# EAGLE schematic printcore_connector (EAGLE 9.5.0)
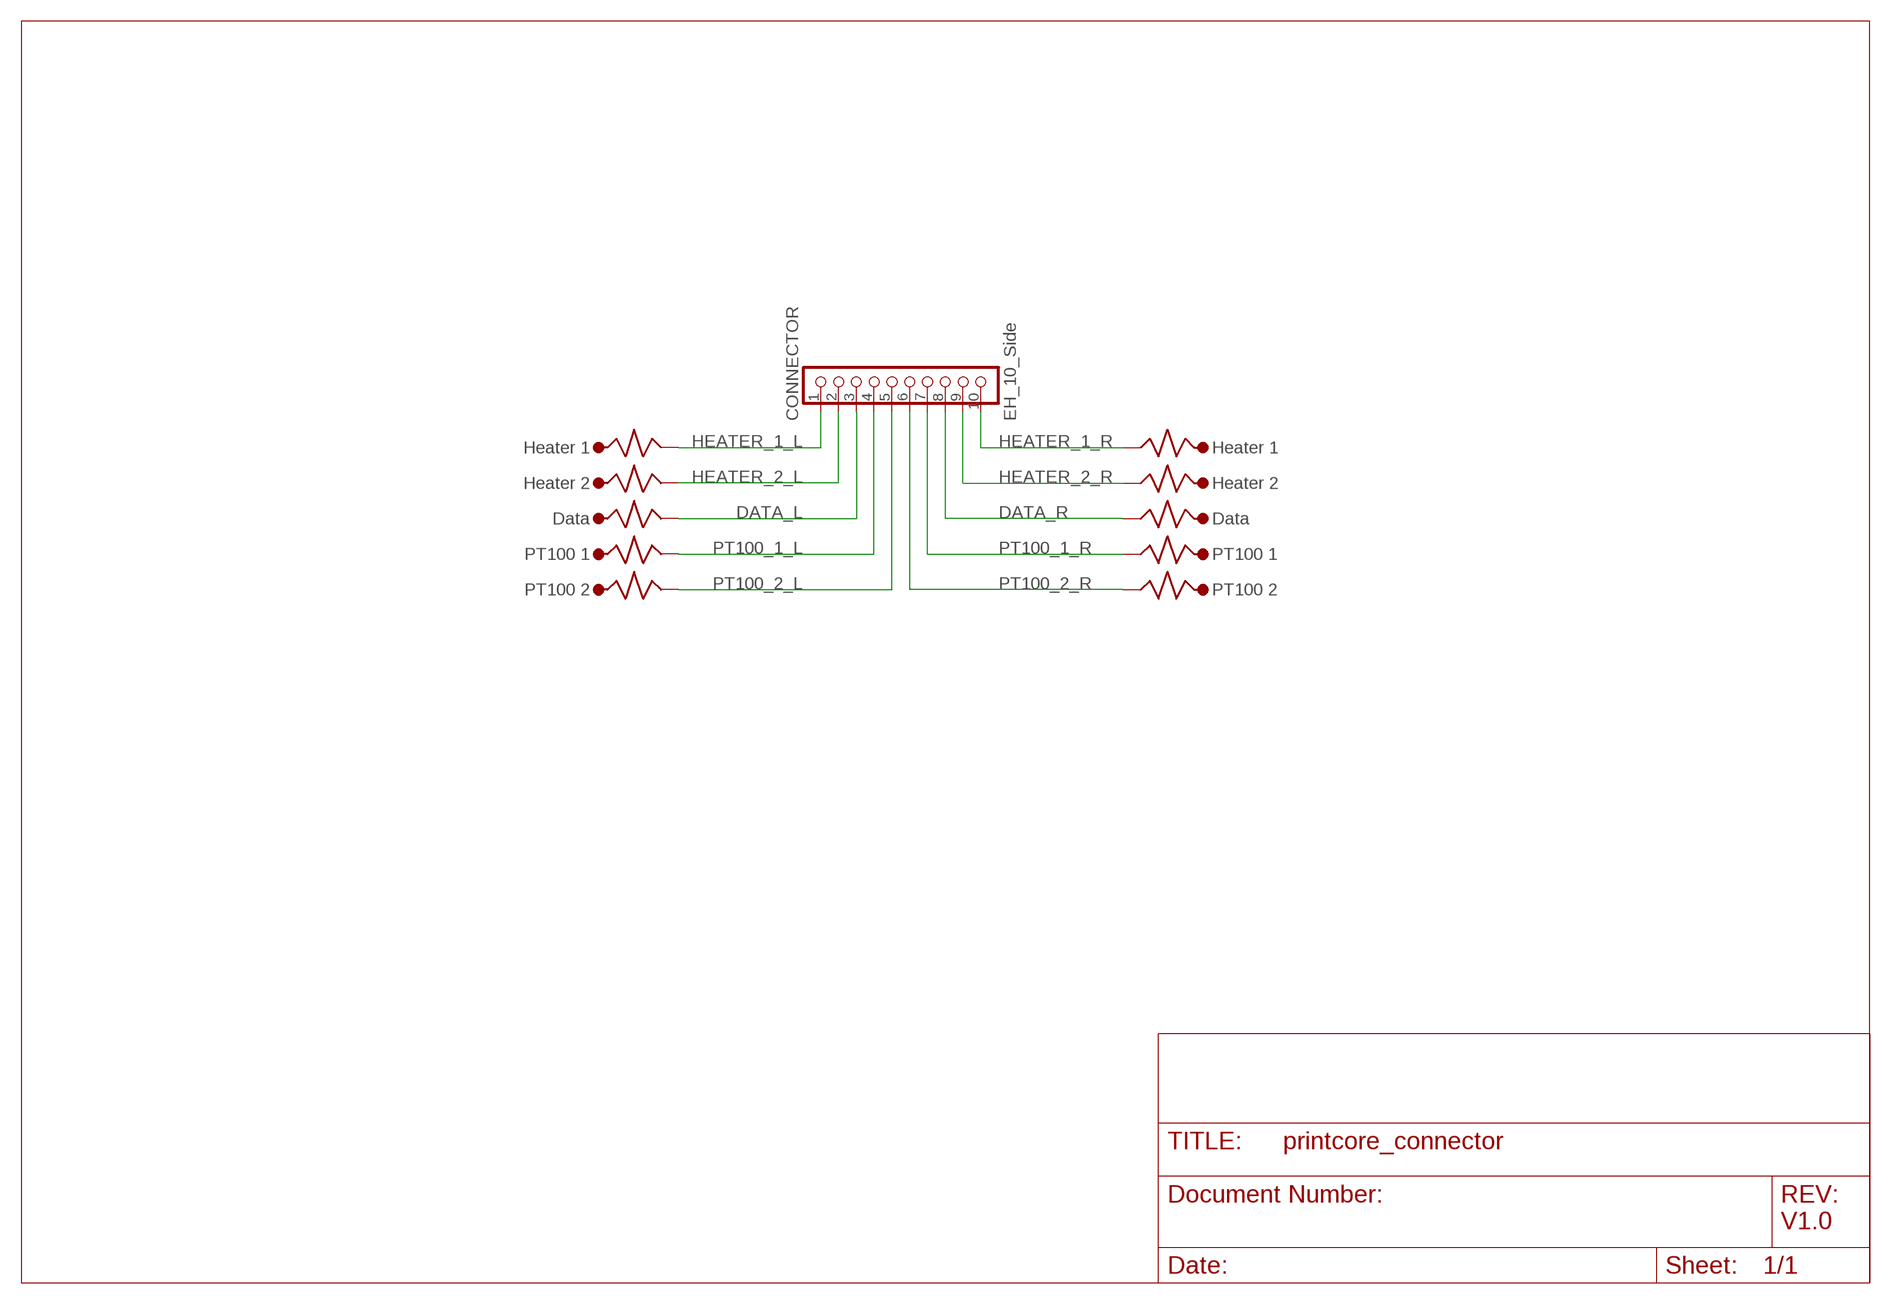
[diagram p0: schematic, sheet 1]

## Parts
CONNECTOR  EH_10_Side  EH_S10B-EH  [S10B-EH]
U$1  ULTIMAKER_PRINTCORE_CONNNECTOR  [ULTIMAKER_PRINTCORE_CONNECTOR]
U$3  ULTIMAKER_PRINTCORE_CONNNECTOR  [ULTIMAKER_PRINTCORE_CONNECTOR]

## Nets
DATA_L: CONNECTOR.3 U$1.DATA
DATA_R: CONNECTOR.8 U$3.DATA
HEATER_1_L: CONNECTOR.1 U$1.HEATER@1(HEATER)
HEATER_1_R: CONNECTOR.10 U$3.HEATER@1(HEATER)
HEATER_2_L: CONNECTOR.2 U$1.HEATER@2(HEATER)
HEATER_2_R: CONNECTOR.9 U$3.HEATER@2(HEATER)
PT100_1_L: CONNECTOR.4 U$1.PT100@1(PT100)
PT100_1_R: CONNECTOR.7 U$3.PT100@1(PT100)
PT100_2_L: CONNECTOR.5 U$1.PT100@2(PT100)
PT100_2_R: CONNECTOR.6 U$3.PT100@2(PT100)

## Notes on the sheet
- V1.0

## Library data of the parts
CONNECTOR = CASE-JST:EH_S10B-EH: JST EH Connector, through hole, 10 pin, side entry Description: JST EH connector with 2.5 mm pitch, through hole version, 10 pin, side entry. Links: Datasheet <http://www.jst-mfg.com/product/pdf/eng/eEH.pdf>
U$1 U$3 = Isaks Bibliotek:ULTIMAKER_PRINTCORE_CONNNECTOR: Uses spring fingers 1.8H: https://se.rs-online.com/web/p/grounding-contacts/1870932/